# EasyEDA schematic SCH_power supply_2023-04-18.json
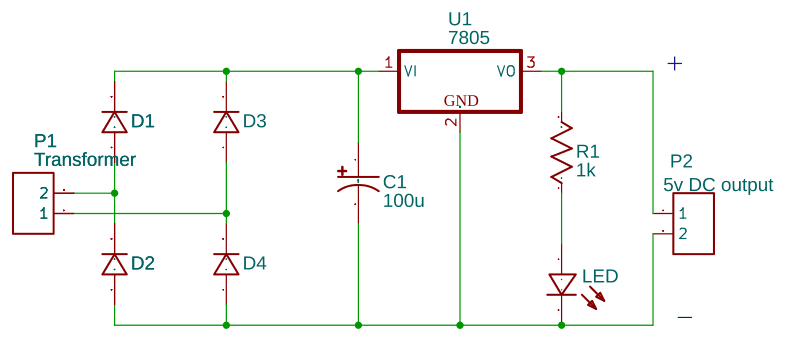
[diagram p0: schematic sheet]

## Parts
C1  100u  [CAP-D3.0XF1.5]
D1  1N4448  [DO-35]
D2  1N4448  [DO-35]
D3  1N4448  [DO-35]
D4  1N4448  [DO-35]
LED  LED-3MM  [LED-3MM/2.54]
P1  Transformer  [HDR-1X2/2.54]
P2  5v DC output  [HDR-1X2/2.54]
R1  1k  [AXIAL-0.3]
U1  7805  [TO220H]

## Library data of the parts
C1 = Cap_Electrolytic(TH)_D3.0XF1.5_US: Manufacturer Part: ?
D1-D4 = -: Supplier: LCSC; Manufacturer: SEMTECH; image: //image.lceda.cn/szlcsc/C54037.jpg; Supplier Part: C54037
LED = -: Supplier: LCSC; Manufacturer: EVERLIGHT; Manufacturer Part: 204-10SURD/S530-A3; Supplier Part: C99772
P1 P2 = -: Supplier: LCSC; Manufacturer: BOOMELE; Manufacturer Part: 2.54-1*2PFemale; image: //image.lceda.cn/szlcsc/C49661.jpg; Supplier Part: C49661
R1 = Res_AXIAL-0.3(1/8W)_US: Manufacturer Part: ?
U1 = -: Contributor: Adafruit; Manufacturer Part: ?

## Nets
Net-(C1-1): C1.1 D1.2(K) D3.2(K) U1.1(VI)
Net-(C1-2): C1.2 D2.1(A) D4.1(A) LED.2(-) P2.2 U1.2(GND)
Net-(D1-1): D1.1(A) D2.2(K) P1.2
Net-(D3-1): D3.1(A) D4.2(K) P1.1
Net-(LED-1): LED.1(+) R1.1
Net-(P2-1): P2.1 R1.2 U1.3(VO)

## Notes on the sheet
- +
- -
